# Altium schematic sheet Sheet1.SchDoc
size A4; SheetNumber: 1; SheetTotal: 1
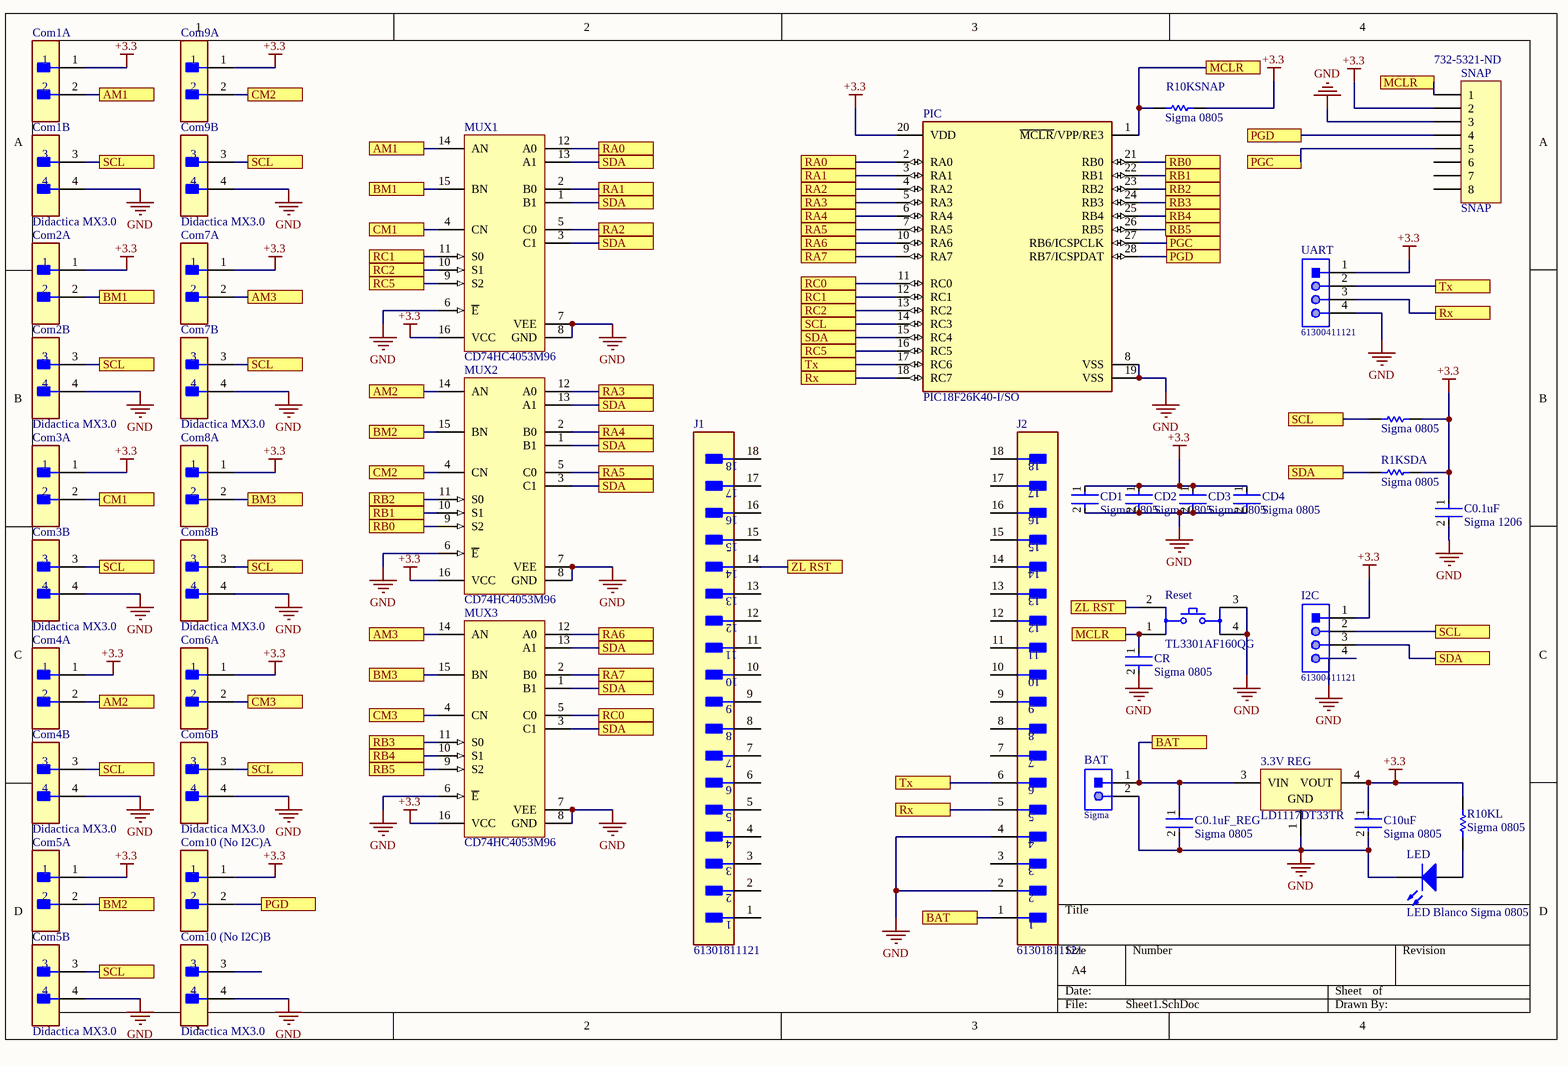
[diagram p0: Sheet1.SchDoc]

## Parts
3.3V_REG  LD1117DT33TR  [TO-252_N]
?  Sigma 0805  [RESC2013X60X35NL10T20]
BAT  Sigma  [61300211121]
C0.1uF  Sigma 1206  [FP-CC1206-1_25-MFG]
C0.1uF_REG  Sigma 0805  [FP-GRM216-0_1-IPC_B]
C10uF  Sigma 0805  [FP-GRM216-0_1-IPC_B]
CD1  Sigma 0805  [FP-GRM216-0_1-IPC_B]
CD2  Sigma 0805  [FP-GRM216-0_1-IPC_B]
CD3  Sigma 0805  [FP-GRM216-0_1-IPC_B]
CD4  Sigma 0805  [FP-GRM216-0_1-IPC_B]
Com1  (no value)  [FP-43045-0427-MFG]  (parts A,B of 2)
Com2  (no value)  [FP-43045-0427-MFG]  (parts A,B of 2)
Com3  (no value)  [FP-43045-0427-MFG]  (parts A,B of 2)
Com4  (no value)  [FP-43045-0427-MFG]  (parts A,B of 2)
Com5  (no value)  [FP-43045-0427-MFG]  (parts A,B of 2)
Com6  (no value)  [FP-43045-0427-MFG]  (parts A,B of 2)
Com7  (no value)  [FP-43045-0427-MFG]  (parts A,B of 2)
Com8  (no value)  [FP-43045-0427-MFG]  (parts A,B of 2)
Com9  (no value)  [FP-43045-0427-MFG]  (parts A,B of 2)
Com10_(No_I2C)  (no value)  [FP-43045-0427-MFG]  (parts A,B of 2)
CR  Sigma 0805  [FP-GRM216-0_1-IPC_B]
I2C  61300411121  [61300411121]
J1  61301811121  [FP-61301811121-MFG]
J2  61301811121  [FP-61301811121-MFG]
LED  LED Blanco Sigma 0805  [0805_A]
MUX1  CD74HC4053M96  [D0016A_N]
MUX2  CD74HC4053M96  [D0016A_N]
MUX3  CD74HC4053M96  [D0016A_N]
PIC  PIC18F26K40-I/SO  [FP-C04-052-IPC_B]
R1KSDA  Sigma 0805  [RESC2013X60X35NL10T20]
R10KL  Sigma 0805  [RESC2013X50X30ML20T20]
R10KSNAP  Sigma 0805  [RESC2013X60X35NL10T20]
Reset  TL3301AF160QG  [FP-TL3301AF160QG-MFG]
SNAP  SNAP  Supplier Part Number 1: 732-5321-ND  [HDR1X8]
UART  61300411121  [61300411121]

## Ports
AM1 (see Sheet1[1A]), AM2 (see Sheet1[1B]), AM2 (see Sheet1[1C]), AM3 (see Sheet1[1B]), AM3 (see Sheet1[1C]), BAT (see Sheet1[3C]), BAT (see Sheet1[3D]), BM1 (see Sheet1[1A]), BM1 (see Sheet1[1B]), BM2 (see Sheet1[1B]), BM2 (see Sheet1[1D]), BM3 (see Sheet1[1B]), BM3 (see Sheet1[1C]), CM1 (see Sheet1[1A]), CM1 (see Sheet1[1B]), CM2 (see Sheet1[1A]), CM2 (see Sheet1[1B]), CM3 (see Sheet1[1C]), MCLR (see Sheet1[3C], Sheet1[4A]), MCLR (see Sheet1[4A]), PGC (see Sheet1[3A]), PGC (see Sheet1[4A]), PGD (see Sheet1[1D], Sheet1[3A]), PGD (see Sheet1[1D], Sheet1[4A]), PGD (see Sheet1[3A], Sheet1[4A]), RA0 (see Sheet1[2A]), RA0 (see Sheet1[3A]), RA1 (see Sheet1[2A]), RA1 (see Sheet1[3A]), RA2 (see Sheet1[2A]), RA2 (see Sheet1[3A]), RA3 (see Sheet1[2B]), RA3 (see Sheet1[3A]), RA4 (see Sheet1[2B]), RA4 (see Sheet1[3A]), RA5 (see Sheet1[2B]), RA5 (see Sheet1[3A]), RA6 (see Sheet1[2C]), RA6 (see Sheet1[3A]), RA7 (see Sheet1[2C]), RA7 (see Sheet1[3A]), RB0 (see Sheet1[1C]), RB0 (see Sheet1[3A]), RB1 (see Sheet1[1B]), RB1 (see Sheet1[3A]), RB2 (see Sheet1[1B]), RB2 (see Sheet1[3A]), RB3 (see Sheet1[1C]), RB3 (see Sheet1[3A]), RB4 (see Sheet1[1C]), RB4 (see Sheet1[3A]), RB5 (see Sheet1[1C]), RB5 (see Sheet1[3A]), RC0 (see Sheet1[2C]), RC0 (see Sheet1[3B]), RC1 (see Sheet1[1A]), RC1 (see Sheet1[3B]), RC2 (see Sheet1[1B]), RC2 (see Sheet1[3B]), RC5 (see Sheet1[1B]), RC5 (see Sheet1[3B]), Rx (see Sheet1[3B], Sheet1[3D]), Rx (see Sheet1[3B], Sheet1[4B]), Rx (see Sheet1[3D], Sheet1[4B]), SCL (see Sheet1[1A], Sheet1[1B], Sheet1[1C], Sheet1[1D], Sheet1[3B], Sheet1[4B]), SCL (see Sheet1[1A], Sheet1[1B], Sheet1[1C], Sheet1[1D], Sheet1[3B], Sheet1[4B], Sheet1[4C]), SCL (see Sheet1[1A], Sheet1[1B], Sheet1[1C], Sheet1[1D], Sheet1[3B], Sheet1[4C]), SCL (see Sheet1[1A], Sheet1[1B], Sheet1[1C], Sheet1[1D], Sheet1[4B], Sheet1[4C]), SCL (see Sheet1[1A], Sheet1[1B], Sheet1[1C], Sheet1[3B], Sheet1[4B], Sheet1[4C]), SDA (see Sheet1[2A], Sheet1[2B], Sheet1[2C], Sheet1[3B], Sheet1[4B]), SDA (see Sheet1[2A], Sheet1[2B], Sheet1[2C], Sheet1[3B], Sheet1[4B], Sheet1[4C]), SDA (see Sheet1[2A], Sheet1[2B], Sheet1[2C], Sheet1[3B], Sheet1[4C]), SDA (see Sheet1[2A], Sheet1[2B], Sheet1[2C], Sheet1[4B], Sheet1[4C]), Tx (see Sheet1[3B], Sheet1[3D]), Tx (see Sheet1[3B], Sheet1[4B]), Tx (see Sheet1[3D], Sheet1[4B]), ZL RST (see Sheet1[3C])

## Nets
+3.3: 3.3V_REG.4(VOUT) ?.1 C0.1uF.1 C10uF.1 CD1.1 CD2.1 CD3.1 CD4.1 Com1.1 Com2.1 Com3.1 Com4.1 Com5.1 Com6.1 Com7.1 Com8.1 Com9.1 Com10_(No_I2C).1 I2C.1 MUX1.16(VCC) MUX2.16(VCC) MUX3.16(VCC) PIC.20(VDD) R1KSDA.1 R10KL.1 R10KSNAP.1 SNAP.2 UART.1
GND: 3.3V_REG.1(GND) BAT.2 C0.1uF.2 C0.1uF_REG.2 C10uF.2 CD1.2 CD2.2 CD3.2 CD4.2 Com1.4 Com2.4 Com3.4 Com4.4 Com5.4 Com6.4 Com7.4 Com8.4 Com9.4 Com10_(No_I2C).4 CR.2 I2C.4 J2.2 J2.4 LED.1(K) MUX1.6(~{E}) MUX1.7(VEE) MUX1.8(GND) MUX2.6(~{E}) MUX2.7(VEE) MUX2.8(GND) MUX3.6(~{E}) MUX3.7(VEE) MUX3.8(GND) PIC.8(VSS) PIC.19(VSS) Reset.3 Reset.4 SNAP.3 UART.4
AM1: Com1.2 MUX1.14(AN) ; port AM1
AM2: Com4.2 MUX2.14(AN) ; port AM2
AM3: Com7.2 MUX3.14(AN) ; port AM3
BAT: 3.3V_REG.3(VIN) BAT.1 C0.1uF_REG.1 J2.1 ; port BAT
BM1: Com2.2 MUX1.15(BN) ; port BM1
BM2: Com5.2 MUX2.15(BN) ; port BM2
BM3: Com8.2 MUX3.15(BN) ; port BM3
CM1: Com3.2 MUX1.4(CN) ; port CM1
CM2: Com9.2 MUX2.4(CN) ; port CM2
CM3: Com6.2 MUX3.4(CN) ; port CM3
MCLR: CR.1 PIC.1(~{MCLR}/VPP/RE3) R10KSNAP.2 Reset.1 SNAP.1 ; port MCLR
PGC: PIC.27(RB6/ICSPCLK) SNAP.5 ; port PGC
PGD: Com10_(No_I2C).2 PIC.28(RB7/ICSPDAT) SNAP.4 ; port PGD
RA0: MUX1.12(A0) PIC.2(RA0) ; port RA0
RA1: MUX1.2(B0) PIC.3(RA1) ; port RA1
RA2: MUX1.5(C0) PIC.4(RA2) ; port RA2
RA3: MUX2.12(A0) PIC.5(RA3) ; port RA3
RA4: MUX2.2(B0) PIC.6(RA4) ; port RA4
RA5: MUX2.5(C0) PIC.7(RA5) ; port RA5
RA6: MUX3.12(A0) PIC.10(RA6) ; port RA6
RA7: MUX3.2(B0) PIC.9(RA7) ; port RA7
RB0: MUX2.9(S2) PIC.21(RB0) ; port RB0
RB1: MUX2.10(S1) PIC.22(RB1) ; port RB1
RB2: MUX2.11(S0) PIC.23(RB2) ; port RB2
RB3: MUX3.11(S0) PIC.24(RB3) ; port RB3
RB4: MUX3.10(S1) PIC.25(RB4) ; port RB4
RB5: MUX3.9(S2) PIC.26(RB5) ; port RB5
RC0: MUX3.5(C0) PIC.11(RC0) ; port RC0
RC1: MUX1.11(S0) PIC.12(RC1) ; port RC1
RC2: MUX1.10(S1) PIC.13(RC2) ; port RC2
RC5: MUX1.9(S2) PIC.16(RC5) ; port RC5
Rx: J2.5 PIC.18(RC7) UART.3 ; port Rx
SCL: ?.2 Com1.3 Com2.3 Com3.3 Com4.3 Com5.3 Com6.3 Com7.3 Com8.3 Com9.3 I2C.2 PIC.14(RC3) ; port SCL
SDA: I2C.3 MUX1.1(B1) MUX1.3(C1) MUX1.13(A1) MUX2.1(B1) MUX2.3(C1) MUX2.13(A1) MUX3.1(B1) MUX3.3(C1) MUX3.13(A1) PIC.15(RC4) R1KSDA.2 ; port SDA
Tx: J2.6 PIC.17(RC6) UART.2 ; port Tx
ZL RST: J1.14 Reset.2 ; port ZL RST
NetLED_2: LED.2(A) R10KL.2

Not connected (* = marked no-connect by the designer): Com10_(No_I2C) 3; J1 1 2 3 4 5 6 7 8 9 10 11 12 13 15 16 17 18; J2 3 7 8 9 10 11 12 13 14 15 16 17 18; SNAP 6 7 8

## Library data of the parts
3.3V_REG = CMP-0244-00088-1: Fixed Low Drop Positive Voltage Regulator, 3.3V, 3-Pin DPAK, Tape and Reel; ComponentLink1Description: Manufacturer URL; PackageVersion: 2011; PackageReference: TO-252; ComponentLink2Description: Datasheet; ComponentLink1URL: http://www.st.com; DatasheetVersion: 1/11/2011; PackageDescription: 3-Pin Transistor Outline Package 2.28 mm Pitch, 9.7 mm Lead Span (DPAK); ComponentLink2URL: http://www.st.com/internet/com/TECHNICAL_RESOURCES/TECHNICAL_LITERATURE/DATASHEET/CD00000544.pdf
? R1KSDA R10KSNAP = CMP-1659-00013-4: Chip Resistor, 10 KOhm, +/- 1%, 0.125 W, -55 to 155 degC, 0805 (2012 Metric), RoHS, Tape and Reel; Manufacturer: Yageo; Voltage Rating: 150 V; Mount: Surface Mount; ComponentLink1Description: Manufacturer URL; ComponentLink2URL: http://www.yageo.com/documents/recent/PYu-RC_Group_51_RoHS_L_04.pdf; Pins: 2; Length: 2 mm; Min Operating Temperature: -55 degC; Height: 0.5 mm; Mounting Technology: Surface Mount; RoHSCompliant: true; REACH SVHC: No SVHC; ComponentLink1URL: http://www.yageo.com/; Max Operating Temperature: 155 degC; PackageReference: 0805; DatasheetVersion: Rev. 4, 02/2016; Package Quantity: 5000; Packaging: Tape and Reel; ComponentLink2Description: Datasheet; PackageDescription: 2-Pin Surface Mounted Device, Body 2 x 1.25 mm
BAT = CMP-1712-00002-4: THT Vertical Pin Header WR-PHD, Pitch 2.54 mm, Single Row, 2 pins; Manufacturer: Wurth Elektronik; Rated Current: 3A; Gender: Male; Withstanding Voltage: 500VAC; Working Voltage: 250VAC; Pitch: 2.54mm; Contact Resistance: 20mOhm; Pin Number: 2; Mounting Technology: THT; Orientation: Vertical; Operating Temperature: -40to105degC; Packaging: Bag; Publisher: WurthElektronik; Datasheet URL: https://katalog.we-online.de/em/datasheet/6130xx11121.pdf; Manufacturer URL: http://www.we-online.de; Row Number: Single; Package Reference: 61300211121; Part Number: 61300211121
C0.1uF = CMP-03422-001172-1: CAP CER 0.1UF 50V X7R 1206; Manufacturer: Yageo; Manufacturer Part Number: CC1206MRX7R9BB104; Automotive Grade: NA; Value: 100 nF; Temperature Coefficient: 15%; Material: Ceramic; Tolerance: 0.2; Height: 1.45mm; Voltage Rating: 50 V; RoHS: TRUE; Lead Free: Yes; Octopart: https://octopart.com/cc1206mrx7r9bb104-yageo-26325919; Device Class L1: Passive Components; Footprint Url: http://www.yageo.com/exep/pages/download/literatures/UPY-C_GEN_24.pdf; Device Class L2: Capacitors; Temperature: -55°C to +125°C; Capacitance: 100 nF; Package: CC1206-1.25; Temperature Range Low: -55°C; Digikey Description: CAP CER 0.1UF 50V X7R 1206; Temperature Characteristic: X7R; Device Class L3: Ceramic Capacitors; Mouser Description: Multilayer Ceramic Capacitors MLCC - SMD/SMT 100nF 50V X7R 20%; Automotive: No; ComponentLink2URL: http://www.yageo.com/documents/recent/UPY-NP0X7R_HV_1KV-to-3KV_11.pdf; ComponentLink2Description: Datasheet; Temperature Range High: +125°C; Category: Cap
C0.1uF_REG C10uF CD1-CD4 CR = CMP-2007-00889-2: Chip Multilayer Ceramic Capacitors for General Purpose, 0805, 3300pF, C0G, 30ppm/°C, 5%, 50V; Insulation Resistance: 10GR; Capacitance: 3.3nF; Mount: Surface Mount; Case/Package: 0805; Case Code (Imperial): 0805; Lead Free: Lead Free; RoHS Compliant: Yes; Dielectric: C0G; Material: Ceramic; Size: 0.6mm; Voltage Rating (DC): 50V; Voltage: 50V; Termination: SMD/SMT; Case Code (Metric): 2012; Construction: Flat; Max Operating Temperature: 125°C; Series: GRM; Min Operating Temperature: -55°C; Temperature Coefficient: 30ppm/°C; Packaging: Tape and Reel; Height: 0.6mm; REACH SVHC: No SVHC; Width: 0.049inch; Length: 2mm; Thickness: 0.028inch; Voltage Rating: 50V; Tolerance: 5%; Number of Pins: 2; Package Quantity: 1; Dielectric Material: Ceramic; Depth: 1.25mm
Com1-Com9 Com10_(No_I2C) = CMP-04776-000336-1: CONN HEADER VERT 4POS 3MM; Glow Wire Compliant: Compliant; Contact Resistance: 10mR; Current Rating: 5A; Voltage Rating: 600V; Number of Contacts: 4; Max Voltage Rating (DC): 250.25kV; Number of Rows: 2; Max Operating Temperature: 105°C; Series: 43045; Package Quantity: 2232; Packaging: Tray; Mount: Through Hole; Pitch: 3mm; REACH SVHC: No SVHC; Row Spacing: 3mm; Contact Plating: Tin; Halogen Free: Low Halogen; Number of Positions: 4; Termination: Solder; Number of Circuits: 4; Radiation Hardening: No; Orientation: Vertical; Min Operating Temperature: -40°C; Contact Material: Brass; Housing Material: Thermoplastic
I2C UART = CMP-1502-01064-1: THT Vertical Pin Header WR-PHD, Pitch 2.54 mm, Single Row, 4 pins; Manufacturer: Wurth Elektronik; Withstanding Voltage: 500VAC; Rated Current: 3A; Working Voltage: 250VAC; Pin Number: 4; Gender: Male; Contact Resistance: 20mOhm; Pitch: 2.54mm; Manufacturer URL: http://www.we-online.de; Operating Temperature: -40to105degC; Packaging: Bag; Mounting Technology: THT; Package Reference: 61300411121; Datasheet URL: https://katalog.we-online.de/em/datasheet/6130xx11121.pdf; Publisher: WurthElektronik; Part Number: 61300411121; Row Number: Single; Orientation: Vertical
J1 J2 = CMP-1502-01099-2: CONN HEADER VERT 18POS 2.54MM; Pitch: 0.1inch; Voltage Rating: 250V; Number of Positions: 18; Gender: Male; Min Operating Temperature: -40°C; Contact Type: Male Pin; Flammability Rating: UL94 V-0; Lead Free: Lead Free; Fastening Type: Pull; RoHS Compliant: Yes; Insulation Color: Black; Contact Mating Length: 0.236inch; Contact Plating: Gold; Number of Contacts: 18; Connector Type: Header; Mount: Through Hole; Number of Rows: 1; Contact Shape: Square; Max Operating Temperature: 105°C; Contact Material: Copper Alloy; Packaging: Bulk; Contact Finish - Mating: GOLD; Insulation Material: Nylon; Color: Black; Termination: Solder; Series: WR-PHD
LED = CMP-1426-00010-1: SMD mono-color Chip LED, WL-SMCW, Super Red; Manufacturer: Wuerth Elektronik; PartNumber: 150080SS75000; PackageReference: 0805_A; ComponentLink2URL: http://katalog.we-online.com/led/datasheet/150080SS75000.pdf; ComponentLink1URL: http://www.we-online.com; Color: Super Red; ComponentLink2Description: Datasheet; ComponentLink1Description: Manufacturer URL
MUX1-MUX3 = CMP-1575-00009-3: High Speed CMOS Triple 2-Channel Analog Multiplexers/Demultiplexers, D0016A, LARGE T&R; Manufacturer: Texas Instruments; VCC(Max)(V): 6; Ron(Typ)(Ohms): 45; VCC(Min)(V): 2; Bandwidth(Max)(MHz): 200; Ron(Max)(Ohms): 130; Rating: Military; Crosstalk: Yes; Configuration: 3 X SPDT; PackageReference: D0016A; Operating Temperature Range(C): -55 to 125; Generic Part Number: CD74HC4053; Code_JEDEC: MS-012 variation AC; DatasheetVersion: SCHS122J; PackageVersion: http://www.ti.com/lit/ml/mpds178g/mpds178g.pdf
PIC = CMP-06276-000356-1: IC MCU 8BIT 64KB FLASH 28SOIC; Core Architecture: PIC; Interface: I2C; Frequency: 64MHz; Peripherals: Brown-out Detect/Reset; Oscillator Type: Internal; Number of I/Os: 25; Case/Package: SOIC; Memory Size: 64KB; RoHS Compliant: Yes; Memory Type: FLASH; Mount: Surface Mount; Packaging: Rail/Tube; Max Operating Temperature: 85°C; Series: PIC® XLP™ 18K; Min Operating Temperature: -40°C
R10KL = CMP-2001-03796-1: Manufacturer: Vishay Dale; Part Number: CRCW0805300KFKEA
Reset = CMP-17879-000012-1: SWITCH TACTILE SPST-NO 0.05A 12V; Actuator Type: Standard; Current Rating: 50mA; Contact Resistance: 100mR; Max Voltage Rating (DC): 50V; Actuator Length: 1.4mm; Electrical Life: 100000Cycles; Throw Configuration: SPST; Switch Travel: 0.25mm; Operating Force: 160gf; Switch Function: Off-Mom; Actuator Material: Nylon; Illumination Type: Non-Illuminated; Orientation: Straight; Lead Free: Lead Free; Contact Material: Silver; Series: TL3301; Mount: Surface Mount; Voltage Rating: 50V; REACH SVHC: No SVHC; Voltage Rating (DC): 12V; Packaging: Tape and Reel; Termination: Gull Wing; RoHS Compliant: Yes; Min Operating Temperature: -20°C; Package Quantity: 1000; Mechanical Life: 100000Cycles; Contact Plating: Silver; Max Operating Temperature: 70°C; Insulation Resistance: 100MR
SNAP = Header 8: Header, 8-Pin; LatestRevisionDate: 17-Jul-2002; LatestRevisionNote: Re-released for DXP Platform.; Publisher: Altium Limited; Supplier 1: Digi-Key